# Altium schematic sheet Relay circuit_12V.SchDoc
size A4; SheetNumber: 4; SheetTotal: 6
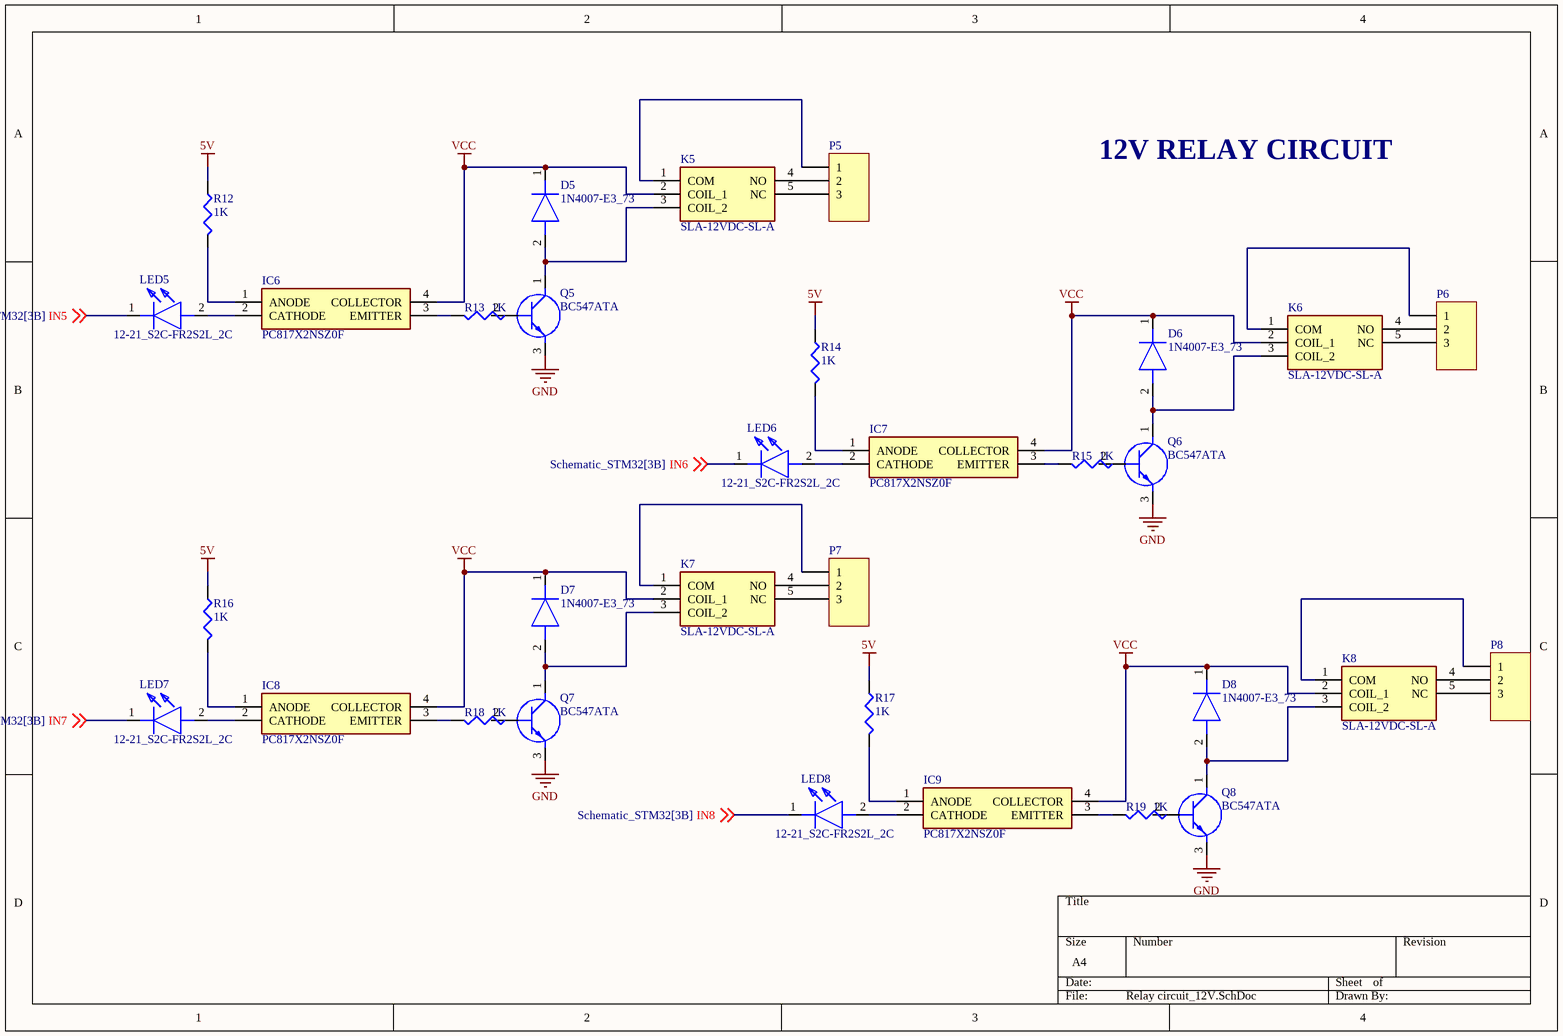
[diagram p0: Relay circuit_12V.SchDoc]

## Parts
D5  1N4007-E3_73  [DIOAD1405W86L465D235]
D6  1N4007-E3_73  [DIOAD1405W86L465D235]
D7  1N4007-E3_73  [DIOAD1405W86L465D235]
D8  1N4007-E3_73  [DIOAD1405W86L465D235]
IC6  PC817X2NSZ0F  [DIP762W60P254L458H400Q4N]
IC7  PC817X2NSZ0F  [DIP762W60P254L458H400Q4N]
IC8  PC817X2NSZ0F  [DIP762W60P254L458H400Q4N]
IC9  PC817X2NSZ0F  [DIP762W60P254L458H400Q4N]
K5  SLA-12VDC-SL-A  [SLA12VDCSLA]
K6  SLA-12VDC-SL-A  [SLA12VDCSLA]
K7  SLA-12VDC-SL-A  [SLA12VDCSLA]
K8  SLA-12VDC-SL-A  [SLA12VDCSLA]
LED5  12-21_S2C-FR2S2L_2C  [1221S2CFR2S2L2C]
LED6  12-21_S2C-FR2S2L_2C  [1221S2CFR2S2L2C]
LED7  12-21_S2C-FR2S2L_2C  [1221S2CFR2S2L2C]
LED8  12-21_S2C-FR2S2L_2C  [1221S2CFR2S2L2C]
P5  Header 3  [CON4PIN5MM]  (value not drawn)
P6  Header 3  [CON4PIN5MM]  (value not drawn)
P7  Header 3  [CON4PIN5MM]  (value not drawn)
P8  Header 3  [CON4PIN5MM]  (value not drawn)
Q5  BC547ATA  [TO-92_(TO-226)]
Q6  BC547ATA  [TO-92_(TO-226)]
Q7  BC547ATA  [TO-92_(TO-226)]
Q8  BC547ATA  [TO-92_(TO-226)]
R12  value 1K  [J1-0603]  (hidden comment: Res3)
R13  value 1K  [J1-0603]  (hidden comment: Res3)
R14  value 1K  [J1-0603]  (hidden comment: Res3)
R15  value 1K  [J1-0603]  (hidden comment: Res3)
R16  value 1K  [J1-0603]  (hidden comment: Res3)
R17  value 1K  [J1-0603]  (hidden comment: Res3)
R18  value 1K  [J1-0603]  (hidden comment: Res3)
R19  value 1K  [J1-0603]  (hidden comment: Res3)

## Nets
5V: R12.1 R14.1 R16.1 R17.1
GND: Q5.3(E) Q6.3(E) Q7.3(E) Q8.3(E)
VCC: D5.1(K) D6.1(K) D7.1(K) D8.1(K) IC6.4(COLLECTOR) IC7.4(COLLECTOR) IC8.4(COLLECTOR) IC9.4(COLLECTOR) K5.2(COIL_1) K6.2(COIL_1) K7.2(COIL_1) K8.2(COIL_1)
IN5: LED5.1(K) ; off-sheet IN5
IN6: LED6.1(K) ; off-sheet IN6
IN7: LED7.1(K) ; off-sheet IN7
IN8: LED8.1(K) ; off-sheet IN8
NetD5_2: D5.2(A) K5.3(COIL_2) Q5.1(C)
NetD6_2: D6.2(A) K6.3(COIL_2) Q6.1(C)
NetD7_2: D7.2(A) K7.3(COIL_2) Q7.1(C)
NetD8_2: D8.2(A) K8.3(COIL_2) Q8.1(C)
NetIC6_1: IC6.1(ANODE) R12.2
NetIC6_2: IC6.2(CATHODE) LED5.2(A)
NetIC6_3: IC6.3(EMITTER) R13.2
NetIC7_1: IC7.1(ANODE) R14.2
NetIC7_2: IC7.2(CATHODE) LED6.2(A)
NetIC7_3: IC7.3(EMITTER) R15.2
NetIC8_1: IC8.1(ANODE) R16.2
NetIC8_2: IC8.2(CATHODE) LED7.2(A)
NetIC8_3: IC8.3(EMITTER) R18.2
NetIC9_1: IC9.1(ANODE) R17.2
NetIC9_2: IC9.2(CATHODE) LED8.2(A)
NetIC9_3: IC9.3(EMITTER) R19.2
NetK5_1: K5.1(COM) P5.1
NetK5_4: K5.4(NO) P5.2
NetK5_5: K5.5(NC) P5.3
NetK6_1: K6.1(COM) P6.1
NetK6_4: K6.4(NO) P6.2
NetK6_5: K6.5(NC) P6.3
NetK7_1: K7.1(COM) P7.1
NetK7_4: K7.4(NO) P7.2
NetK7_5: K7.5(NC) P7.3
NetK8_1: K8.1(COM) P8.1
NetK8_4: K8.4(NO) P8.2
NetK8_5: K8.5(NC) P8.3

Not connected (* = marked no-connect by the designer): P5 4; P6 4; P7 4; P8 4; Q5 2(B); Q6 2(B); Q7 2(B); Q8 2(B); R13 1; R15 1; R18 1; R19 1

## Notes on the sheet
- 12V RELAY CIRCUIT

## Library data of the parts
D5-D8 = 1N4007-E3_73: Diode; Manufacturer_Name: Vishay; Manufacturer_Part_Number: 1N4007-E3/73; Datasheet Link: https://mouser.componentsearchengine.com/Datasheets/2/1N4007-E3_73.pdf; Mouser Part Number: 625-1N4007-E3/73; Mouser Price/Stock: https://www.mouser.co.uk/ProductDetail/Vishay-General-Semiconductor/1N4007-E3-73?qs=N4vtoAxH%2FSqT3Ng3e4K0Gw%3D%3D; Arrow Part Number: 1N4007-E3/73; Arrow Price/Stock: https://www.arrow.com/en/products/1n4007-e373/vishay?region=europe
IC6-IC9 = PC817X2NSZ0F: Integrated Circuit; Manufacturer_Name: Sharp Microelectronics; Datasheet Link: https://datasheet.datasheetarchive.com/originals/distributors/Datasheets_SAMA/458e45842a103a05998fcebbd6f7366e.pdf; Height: 4mm; Manufacturer_Part_Number: PC817X2NSZ0F; Mouser Part Number: N/A; Mouser Price/Stock: https://www.mouser.co.uk/ProductDetail/Sharp-Microelectronics/PC817X2NSZ0F?qs=6kT3pPPHxnU7uYWM8Yy85A%3D%3D
K5-K8 = SLA-12VDC-SL-A: Relay or Contactor; Manufacturer_Name: Songle Relay; Datasheet Link: https://datasheet.lcsc.com/szlcsc/1811200235_Ningbo-Songle-Relay-SLA-12VDC-SL-A_C55194.pdf; Height: 20.4mm; Manufacturer_Part_Number: SLA-12VDC-SL-A
LED5-LED8 = 12-21_S2C-FR2S2L_2C: LED; Manufacturer_Name: Everlight; Manufacturer_Part_Number: 12-21/S2C-FR2S2L/2C; Datasheet Link: https://datasheet.lcsc.com/szlcsc/1901141904_Everlight-Elec-12-21-S2C-FR2S2L-2C_C183856.pdf; Height: 2.2mm
P5-P8 = Header 4: Header, 4-Pin; LatestRevisionDate: 17-Jul-2002; LatestRevisionNote: Re-released for DXP Platform.; Publisher: Altium Limited
Q5-Q8 = BC547ATA: Transistor BJT NPN; Manufacturer_Name: onsemi; Datasheet Link: https://www.onsemi.com/pub/Collateral/BC550-D.pdf; Manufacturer_Part_Number: BC547ATA; Mouser Part Number: 512-BC547ATA; Mouser Price/Stock: https://www.mouser.co.uk/ProductDetail/onsemi-Fairchild/BC547ATA?qs=ljbEvF4DwOMRdLfuzO8N4w%3D%3D; Arrow Part Number: BC547ATA; Arrow Price/Stock: https://www.arrow.com/en/products/bc547ata/on-semiconductor?region=europe
R12-R19 = Res3: Resistor; Published: 8-Jun-2000; LatestRevisionDate: 29-May-2009; LatestRevisionNote: IPC-7351 Footprint Added.; PackageReference: J1-0603; Publisher: Altium Limited; PackageDescription: Chip Resistor